# EAGLE design pavle (EAGLE 9.0.1)
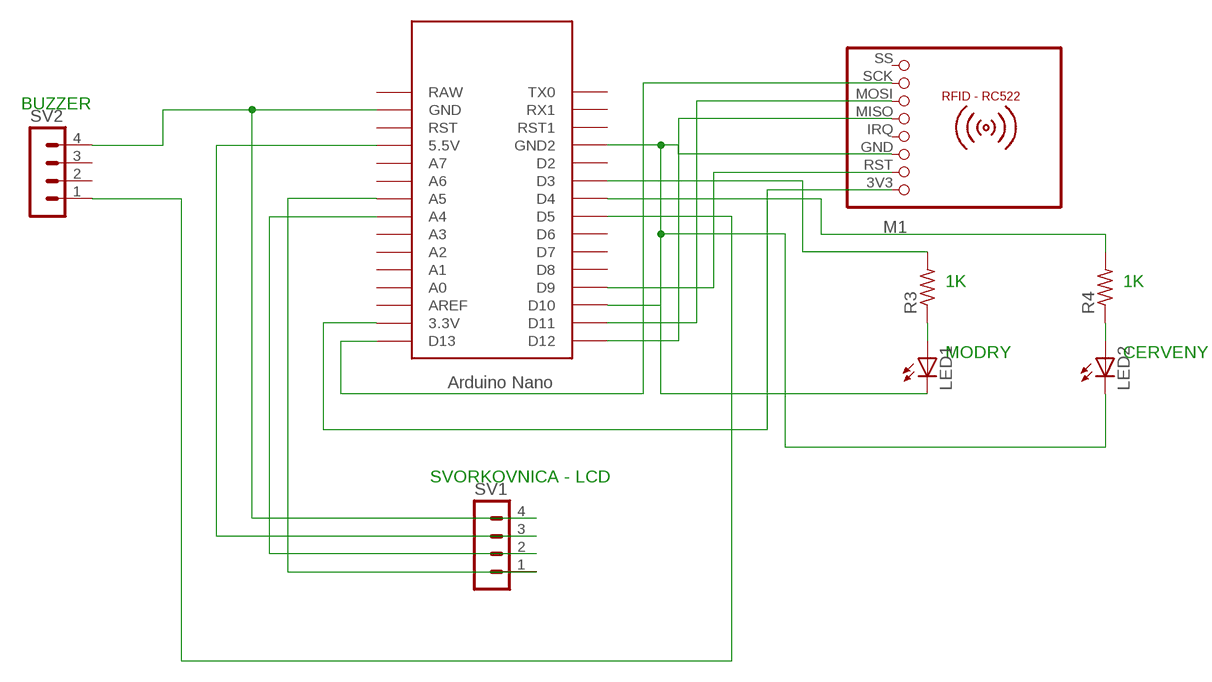
[diagram p0: schematic, sheet 1]

## Parts
LED1  LED3MM  [LED3MM]
LED2  LED3MM  [LED3MM]
M1  RFID-RC522  [RFID-RC522]
R3  R-US_0414/5V  [0414V]
R4  R-US_0414/5V  [0414V]
SV1  MA04-1  [MA04-1]
SV2  MA04-1  [MA04-1]
U$1  NANO  [NANO]

## Nets
N$1: M1.3V3 U$1.3.3V
N$2: LED1.K(C) LED2.K(C) M1.GND U$1.GND1(GND2)
N$3: M1.RST U$1.D9
N$4: M1.MISO U$1.D12
N$5: M1.MOSI U$1.D11
N$6: M1.SCK U$1.D13
N$7: U$1.D10
N$8: SV1.4 SV2.4 U$1.GND
N$9: SV1.3 U$1.5V(5.5V)
N$10: SV1.2 U$1.A4
N$11: SV1.1 U$1.A5
N$13: LED1.A R3.1
N$14: LED2.A R4.1
N$15: R3.2 U$1.D3
N$16: R4.2 U$1.D4
N$18: SV2.1 U$1.D5
Unconnected: M1.IRQ M1.SS SV2.2 SV2.3 U$1.A0 U$1.A1 U$1.A2 U$1.A3 U$1.A6 U$1.A7 U$1.AREF U$1.D2 U$1.D6 U$1.D7 U$1.D8 U$1.ICSP1 U$1.ICSP2 U$1.ICSP3 U$1.ICSP4 U$1.ICSP5 U$1.ICSP6 U$1.RAW U$1.RST U$1.RST1 U$1.RX1 U$1.TX0

## Notes on the sheet
- BUZZER
- 1K | 1K
- MODRY | CERVENY
- SVORKOVNICA - LCD

## Library data of the parts
LED1 LED2 = adafruit:LED: LED OSRAM: - CHIPLED LG R971, LG N971, LY N971, LG Q971, LY Q971, LO R971, LY R971 LH N974, LH R974 LS Q976, LO Q976, LY Q976 LO Q996 - Hyper CHIPLED LW Q18S LB Q993, LB Q99A, LB R99A - SideLED LS A670, LO A670, LY A670, LG A670, LP A670 LB A673, LV A673, LT A673, LW A673 LH A674 LY A675 LS A676, LA A676, LO A676, LY A676, LW A676 LS A679, LY A679, LG A679 - Hyper Micro SIDELED® LS Y876, LA Y876, LO Y876, LY Y876 LT Y87S - SmartLED LW L88C, LW L88S LB L89C, LB L89S, LG L890 LS L89K, LO L89K, LY L89K LS L896, LA L896, LO L896, LY L896 - TOPLED LS T670, LO T670, LY T670, LG T670, LP T670 LSG T670, LSP T670, LSY T670, LOP T670, LYG T670 LG T671, LOG T671, LSG T671 LB T673, LV T673, LT T673, LW T673 LH T674 LS T676, LA T676, LO T676, LY T676, LB T676, LH T676, LSB T676, LW T676 LB T67C, LV T67C, LT T67C, LS T67K, LO T67K, LY T67K, LW E67C LS E67B, LA E67B, LO E67B, LY E67B, LB E67C, LV E67C, LT E67C LW T67C LS T679, LY T679, LG T679 LS T770, LO T770, LY T770, LG T770, LP T770 LB T773, LV T773, LT T773, LW T773 LH T774 LS E675, LA E675, LY E675, LS T675 LS T776, LA T776, LO T776, LY T776, LB T776 LHGB T686 LT T68C, LB T68C - Hyper Mini TOPLED® LB M676 - Mini TOPLED Santana® LG M470 LS M47K, LO M47K, LY M47K Source: http://www.osram.convergy.de/
M1 = mfrc522-module:RFID-RC522: RFID-RC522 MFRC-522 based breakout board
R3 R4 = adafruit:R-US_: RESISTOR, American symbol
SV1 SV2 = con-lstb:MA04-1: PIN HEADER; OC_FARNELL: unknown; OC_NEWARK: unknown
U$1 = Arduino-clone:NANO: Arduino Nano

## Board
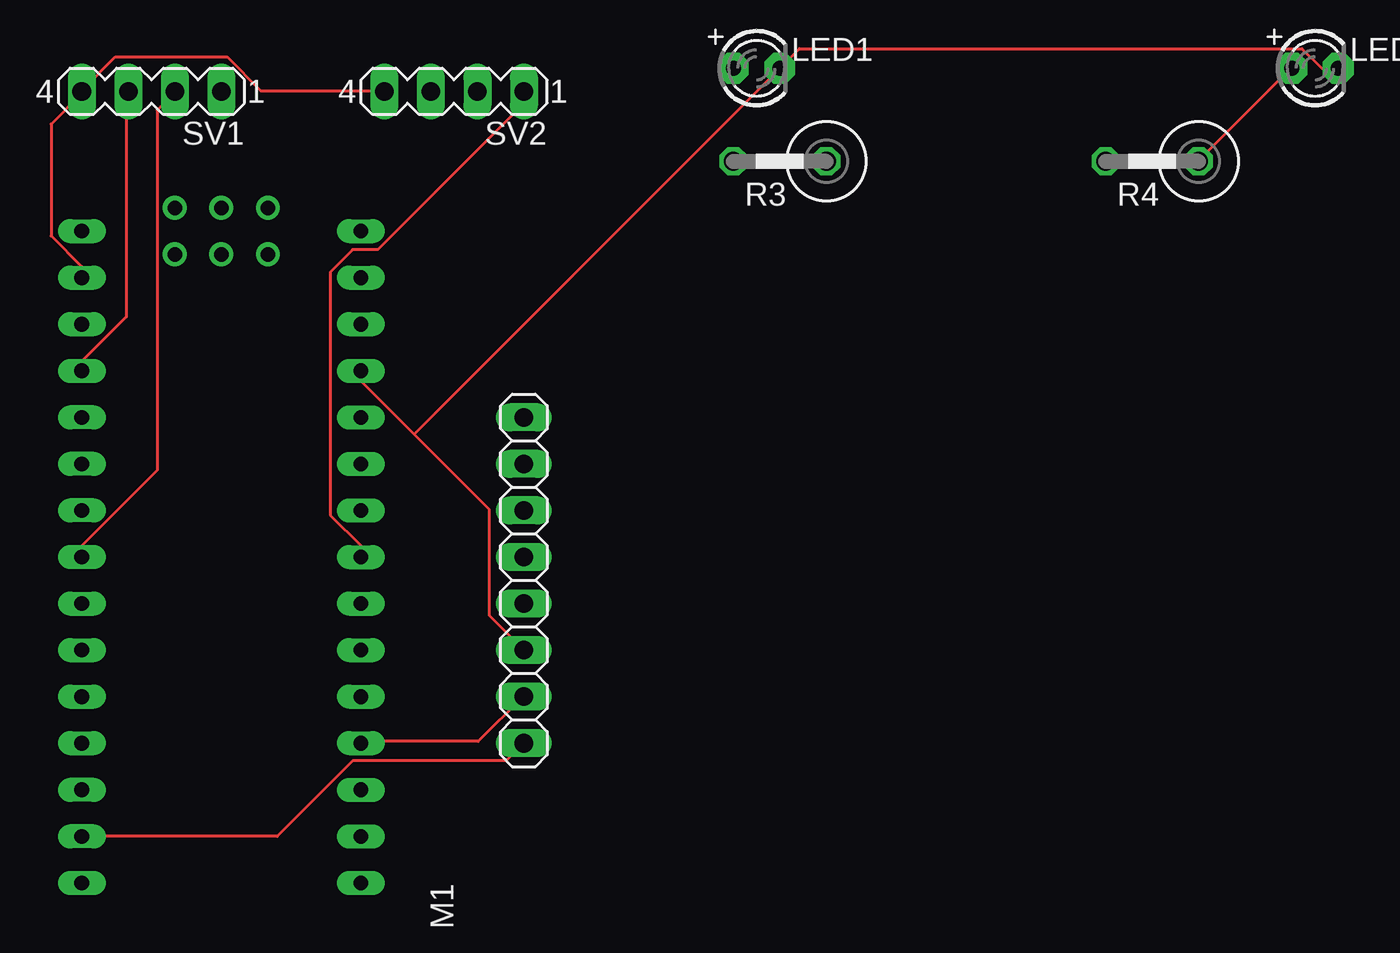
[diagram p1: board, top side]
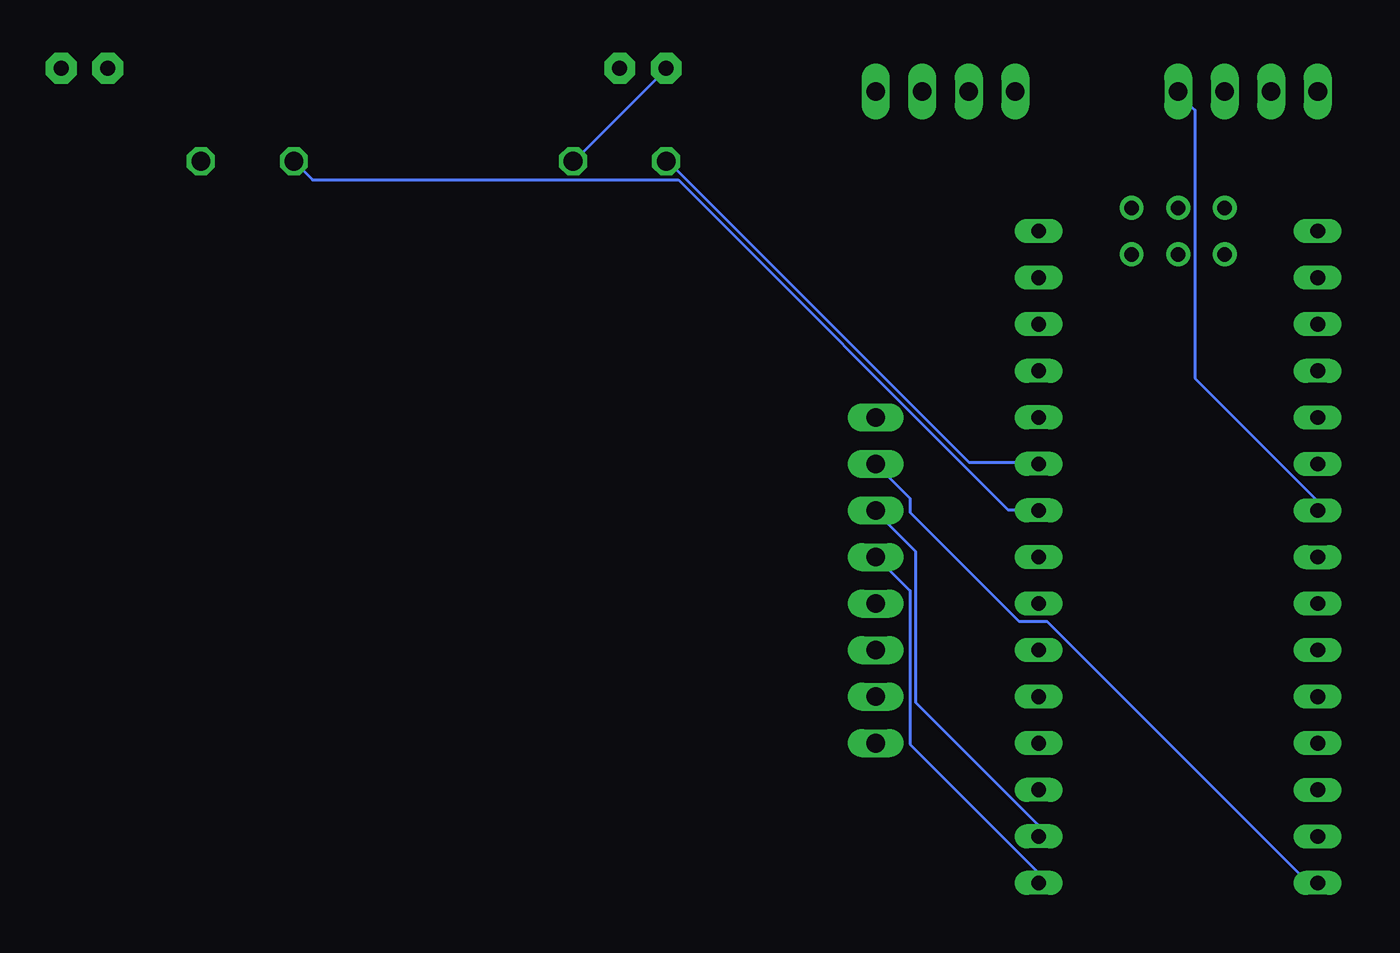
[diagram p2: board, bottom side, seen from below]

No outline drawn. Coordinates in mm, seen from the top.
Copper layers (1*16): Top 0.035mm / dielectric 1.5mm / Bottom 0.035mm
Design rules "default": minimum track width 6mil, minimum drill 0.35mm, track to track 6mil, track to pad 6mil, pad to pad 6mil, via to via 6mil, smd to smd 6mil, copper to edge 40mil, drill to drill 6mil, minimum pad ring 10mil, minimum via ring 8mil, stop-mask expansion 4mil, vias tented up to drill 0mil, thermal gap 10mil

### Footprints (pad centres in the part's own frame; a part is rotated, then mirrored left to right if it is on the bottom)
LED3MM = drill 0.813 pad 1.676 octagon: A -1.27,0; K 1.27,0
RFID-RC522 = drill 1.016 long: 3V3 -8.89,0; GND -3.81,0; IRQ -1.27,0; MISO 1.27,0; MOSI 3.81,0; RST -6.35,0; SCK 6.35,0; SS 8.89,0
0414V = drill 1.016 octagon: 1 -2.54,0; 2 2.54,0
MA04-1 = drill 1.016 long: 1 -3.81,0; 2 -1.27,0; 3 1.27,0; 4 3.81,0
NANO = drill 0.8 long: 3.3V -10.16,24.13; 5V -10.16,-1.27; A0 -10.16,19.05; A1 -10.16,16.51; A2 -10.16,13.97; A3 -10.16,11.43; A4 -10.16,8.89; A5 -10.16,6.35; A6 -10.16,3.81; A7 -10.16,1.27; AREF -10.16,21.59; D2 5.08,1.27; D3 5.08,3.81; D4 5.08,6.35; D5 5.08,8.89; D6 5.08,11.43; D7 5.08,13.97; D8 5.08,16.51; D9 5.08,19.05; D10 5.08,21.59; D11 5.08,24.13; D12 5.08,26.67; D13 -10.16,26.67; GND -10.16,-6.35; GND1 5.08,-1.27; RAW -10.16,-8.89; RST -10.16,-3.81; RST1 5.08,-3.81; RX1 5.08,-6.35; TX0 5.08,-8.89 | drill 0.8: ICSP1 -5.08,-10.16; ICSP2 -5.08,-7.62; ICSP3 -2.54,-10.16; ICSP4 -2.54,-7.62; ICSP5 0,-10.16; ICSP6 0,-7.62

### Placement (x,y rotation side)
LED1  40.64,45.72 0 top
LED2  71.12,45.72 0 top
M1  27.94,17.78 90 top
R3  41.91,40.64 180 top
R4  62.23,40.64 180 top
SV1  7.62,44.45 180 top
SV2  24.13,44.45 180 top
U$1  13.97,27.94 180 bottom

### Tracks (layer width: path | path; a pad name or v marks a point on that pad's centre or on a via)
N$1
  Top 0.152: U$1.3.3V 14.48,3.81 18.59,7.92 26.98,7.92 M1.3V3
N$2
  Top 0.152: U$1.GND1 19.05,28.65 21.95,25.76 | 21.95,25.76 26.06,21.64 26.06,15.85 M1.GND | 21.95,25.76 LED1.K 42.98,46.79 70.41,46.79 71.48,45.72 LED2.K
N$3
  Top 0.152: U$1.D9 19.05,8.99 25.45,8.99 27.89,11.43 M1.RST
N$4
  Bottom 0.152: U$1.D12 19.05,1.83 26.06,8.84 26.06,17.22 27.89,19.05 M1.MISO
N$5
  Bottom 0.152: U$1.D11 19.05,4.42 25.76,11.12 25.76,19.36 27.89,21.49 M1.MOSI
N$6
  Bottom 0.152: M1.SCK 26.06,22.25 26.06,21.49 20.12,15.54 18.59,15.54 4.42,1.37 3.81,1.37 U$1.D13
N$8
  Top 0.152: U$1.GND 3.81,34.9 2.13,36.58 2.13,42.67 3.81,44.35 SV1.4 3.81,44.5 5.64,46.33 11.73,46.33 13.56,44.5 20.27,44.5 SV2.4
N$9
  Top 0.152: U$1.5V 3.81,29.72 6.25,32.16 6.25,44.35 SV1.3
N$10
  Top 0.152: U$1.A4 3.81,19.66 7.92,23.77 7.92,43.43 8.84,44.35 SV1.2
N$11
  Bottom 0.152: U$1.A5 3.81,22.1 10.52,28.8 10.52,43.43 11.43,44.35 SV1.1
N$13
  Bottom 0.152: R3.1 44.35,40.69 39.32,45.72 LED1.A
N$14
  Top 0.152: R4.1 64.77,40.69 69.8,45.72 LED2.A
N$15
  Bottom 0.152: U$1.D3 19.05,24.23 22.86,24.23 39.32,40.69 R3.2
N$16
  Bottom 0.152: R4.2 58.67,39.62 38.71,39.62 20.73,21.64 19.05,21.64 U$1.D4
N$18
  Top 0.152: U$1.D5 19.05,19.66 17.37,21.34 17.37,34.59 18.59,35.81 19.96,35.81 27.89,43.74 27.89,44.35 SV2.1